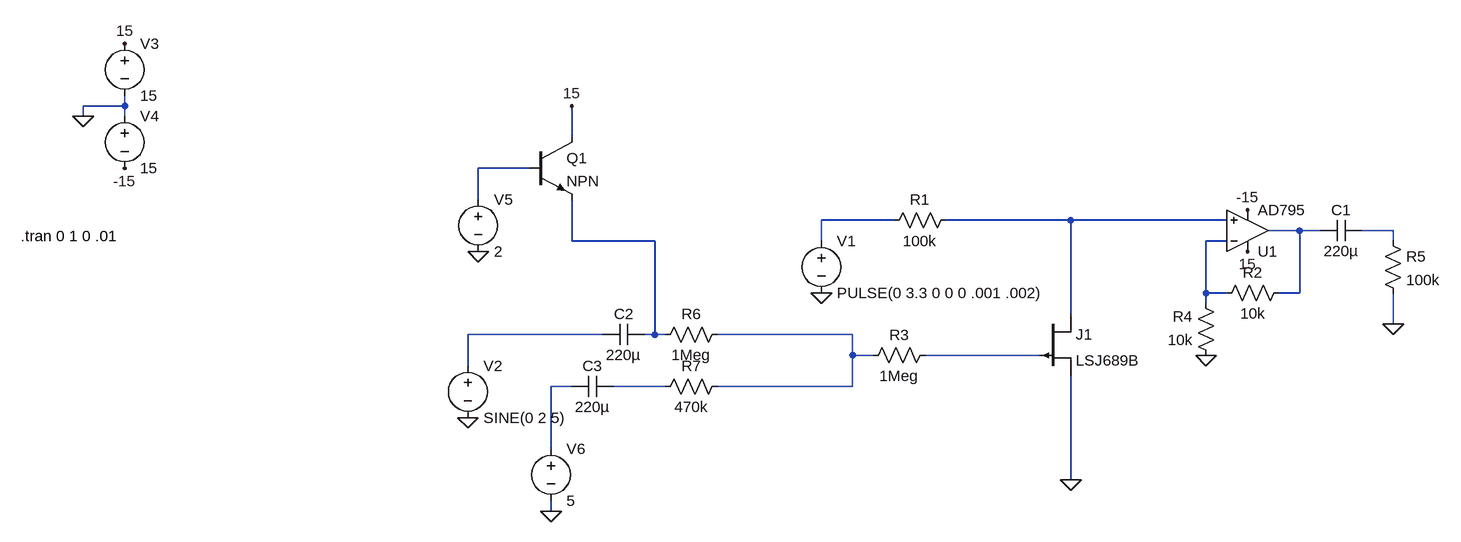
[diagram p0: schematic P-Channel JFET VGA for envelope generator.asc]
P-Channel JFET VGA for envelope generator.asc, the LTspice schematic file:
Version 4
SHEET 1 880 680
WIRE -1296 -128 -1296 -144
WIRE -1296 -128 -1360 -128
WIRE -1360 -112 -1360 -128
WIRE -1296 -112 -1296 -128
WIRE -608 -80 -608 -128
WIRE -672 -32 -752 -32
WIRE -752 16 -752 -32
WIRE -112 48 -224 48
WIRE 160 48 -32 48
WIRE 400 48 160 48
WIRE 512 64 464 64
WIRE 544 64 512 64
WIRE 656 64 608 64
WIRE -608 80 -608 16
WIRE -480 80 -608 80
WIRE -224 80 -224 48
WIRE 400 80 368 80
WIRE 656 80 656 64
WIRE 368 160 368 80
WIRE 400 160 368 160
WIRE 512 160 512 64
WIRE 512 160 480 160
WIRE 368 176 368 160
WIRE 160 192 160 48
WIRE 656 208 656 160
WIRE -560 224 -768 224
WIRE -480 224 -480 80
WIRE -480 224 -496 224
WIRE -464 224 -480 224
WIRE -176 224 -384 224
WIRE -176 256 -176 224
WIRE -144 256 -176 256
WIRE 112 256 -64 256
WIRE -768 272 -768 224
WIRE -608 304 -640 304
WIRE -464 304 -544 304
WIRE -176 304 -176 256
WIRE -176 304 -384 304
WIRE -640 400 -640 304
WIRE 160 448 160 288
WIRE -640 496 -640 480
FLAG -224 160 0
FLAG -1360 -112 0
FLAG -1296 -224 15
FLAG -1296 -32 -15
FLAG 432 32 -15
FLAG 432 96 15
FLAG 368 256 0
FLAG 160 448 0
FLAG 656 208 0
FLAG -768 352 0
FLAG -752 96 0
FLAG -608 -128 15
FLAG -640 496 0
DATAFLAG -224 48 ""
DATAFLAG 160 48 ""
DATAFLAG 160 320 ""
DATAFLAG 0 256 ""
DATAFLAG -176 256 ""
SYMBOL res -16 32 R90
WINDOW 0 0 56 VBottom 2
WINDOW 3 32 56 VTop 2
SYMATTR InstName R1
SYMATTR Value 100k
SYMBOL res -160 272 R270
WINDOW 0 32 56 VTop 2
WINDOW 3 0 56 VBottom 2
SYMATTR InstName R3
SYMATTR Value 1Meg
SYMBOL voltage -224 64 R0
WINDOW 123 0 0 Left 0
WINDOW 39 0 0 Left 0
SYMATTR InstName V1
SYMATTR Value PULSE(0 3.3 0 0 0 .001 .002)
SYMBOL voltage -768 256 R0
WINDOW 123 0 0 Left 0
WINDOW 39 0 0 Left 0
SYMATTR InstName V2
SYMATTR Value SINE(0 2 5)
SYMBOL voltage -1296 -240 R0
WINDOW 123 0 0 Left 0
WINDOW 39 0 0 Left 0
SYMATTR InstName V3
SYMATTR Value 15
SYMBOL voltage -1296 -128 R0
WINDOW 123 0 0 Left 0
WINDOW 39 0 0 Left 0
SYMATTR InstName V4
SYMATTR Value 15
SYMBOL Opamps\\AD795 432 128 M180
SYMATTR InstName U1
SYMBOL res 496 144 R90
WINDOW 0 0 56 VBottom 2
WINDOW 3 32 56 VTop 2
SYMATTR InstName R2
SYMATTR Value 10k
SYMBOL res 384 272 R180
WINDOW 0 36 76 Left 2
WINDOW 3 36 40 Left 2
SYMATTR InstName R4
SYMATTR Value 10k
SYMBOL cap 608 48 R90
WINDOW 0 0 32 VBottom 2
WINDOW 3 32 32 VTop 2
SYMATTR InstName C1
SYMATTR Value 220µ
SYMBOL res 640 64 R0
SYMATTR InstName R5
SYMATTR Value 100k
SYMBOL pjf 112 192 R0
SYMATTR InstName J1
SYMATTR Value LSJ689B
SYMBOL res -480 240 R270
WINDOW 0 32 56 VTop 2
WINDOW 3 0 56 VBottom 2
SYMATTR InstName R6
SYMATTR Value 1Meg
SYMBOL res -480 320 R270
WINDOW 0 32 56 VTop 2
WINDOW 3 0 56 VBottom 2
SYMATTR InstName R7
SYMATTR Value 470k
SYMBOL cap -496 208 R90
WINDOW 0 0 32 VBottom 2
WINDOW 3 32 32 VTop 2
SYMATTR InstName C2
SYMATTR Value 220µ
SYMBOL voltage -752 0 R0
WINDOW 123 0 0 Left 0
WINDOW 39 0 0 Left 0
SYMATTR InstName V5
SYMATTR Value 2
SYMBOL npn -672 -80 R0
SYMATTR InstName Q1
SYMBOL voltage -640 384 R0
WINDOW 123 0 0 Left 0
WINDOW 39 0 0 Left 0
SYMATTR InstName V6
SYMATTR Value 5
SYMBOL cap -544 288 R90
WINDOW 0 0 32 VBottom 2
WINDOW 3 32 32 VTop 2
SYMATTR InstName C3
SYMATTR Value 220µ
TEXT -1456 72 Left 2 !.tran 0 1 0 .01

The netlist it stands for:
* P-Channel JFET VGA for envelope generator.asc
R1 N003 N002 100k
R3 N009 N010 1Meg
V1 N002 0 PULSE(0 3.3 0 0 0 .001 .002)
V2 N008 0 SINE(0 2 5)
V3 15 0 15
V4 0 -15 15
XU1 N003 N007 15 -15 N004 AD795  ; pins In+ In- V+ V- OUT
R2 N004 N007 10k
R4 0 N007 10k
C1 N005 N004 220µ
R5 N005 0 100k
J1 N003 N010 0 LSJ689B
R6 N006 N009 1Meg
R7 N012 N009 470k
C2 N006 N008 220µ
V5 N001 0 2
Q1 15 N001 N006 0 NPN
V6 N011 0 5
C3 N012 N011 220µ
.model NPN NPN
.model PNP PNP
.lib standard.bjt
.model NJF NJF
.model PJF PJF
.lib standard.jft
.tran 0 1 0 .01
.lib ADI1.lib
.backanno
.end